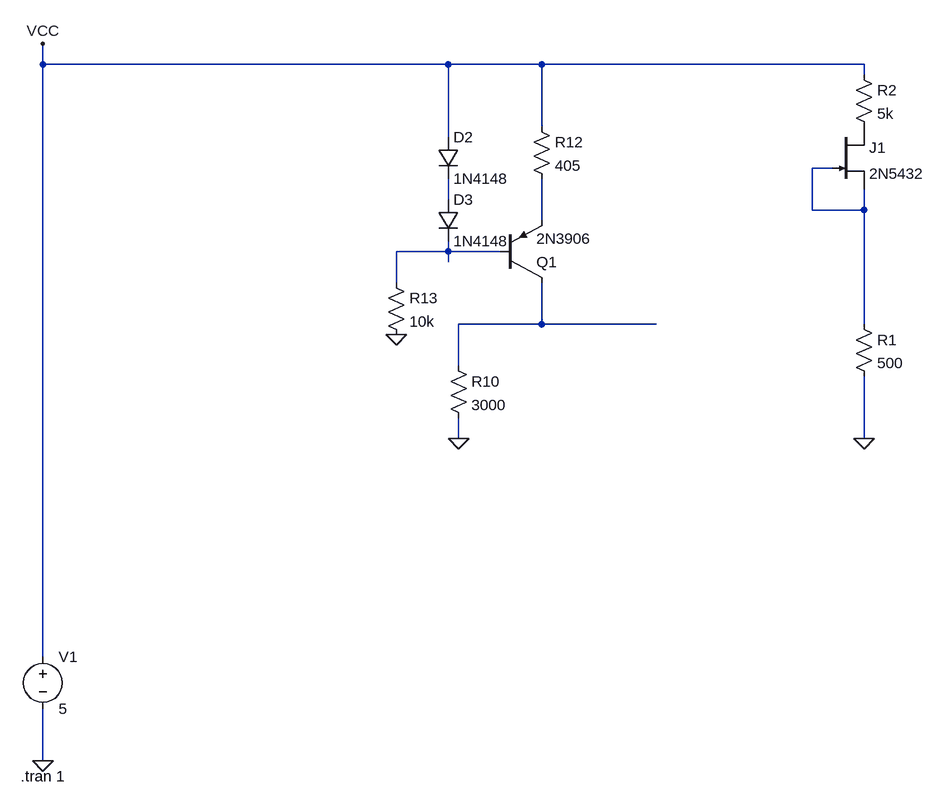
[diagram p0: schematic ccs-test.asc]
ccs-test.asc, the LTspice schematic file:
Version 4
SHEET 1 880 680
WIRE -544 -1104 -544 -1136
WIRE 80 -1104 -544 -1104
WIRE 224 -1104 80 -1104
WIRE 720 -1104 224 -1104
WIRE 720 -1088 720 -1104
WIRE 224 -1008 224 -1104
WIRE 80 -992 80 -1104
WIRE 672 -944 640 -944
WIRE 80 -896 80 -928
WIRE 640 -880 640 -944
WIRE 720 -880 720 -912
WIRE 720 -880 640 -880
WIRE 224 -864 224 -928
WIRE 80 -816 80 -832
WIRE 80 -816 0 -816
WIRE 160 -816 80 -816
WIRE 80 -800 80 -816
WIRE 0 -768 0 -816
WIRE 224 -704 224 -768
WIRE 224 -704 96 -704
WIRE 400 -704 224 -704
WIRE 720 -704 720 -880
WIRE 96 -640 96 -704
WIRE 96 -528 96 -560
WIRE 720 -528 720 -624
WIRE -544 -192 -544 -1104
WIRE -544 -32 -544 -112
FLAG -544 -32 0
FLAG -544 -1136 VCC
FLAG 0 -688 0
FLAG 96 -528 0
FLAG 720 -528 0
SYMBOL voltage -544 -208 R0
WINDOW 123 0 0 Left 2
WINDOW 39 0 0 Left 2
SYMATTR InstName V1
SYMATTR Value 5
SYMBOL res 80 -656 R0
SYMATTR InstName R10
SYMATTR Value 3000
SYMBOL diode 64 -992 R0
SYMATTR InstName D2
SYMATTR Value 1N4148
SYMBOL diode 64 -896 R0
SYMATTR InstName D3
SYMATTR Value 1N4148
SYMBOL res 208 -1024 R0
SYMATTR InstName R12
SYMATTR Value 405
SYMBOL res -16 -784 R0
SYMATTR InstName R13
SYMATTR Value 10k
SYMBOL pnp 160 -768 M180
SYMATTR InstName Q1
SYMATTR Value 2N3906
SYMBOL njf 672 -1008 R0
SYMATTR InstName J1
SYMATTR Value 2N5432
SYMBOL res 704 -720 R0
SYMATTR InstName R1
SYMATTR Value 500
SYMBOL res 704 -1104 R0
SYMATTR InstName R2
SYMATTR Value 5k
TEXT -578 -8 Left 2 !.tran 1

The netlist it stands for:
* ccs-test.asc
V1 VCC 0 5
R10 N005 0 3000
D2 VCC N002 1N4148
D3 N002 N004 1N4148
R12 VCC N003 405
R13 N004 0 10k
Q1 N005 N004 N003 0 2N3906
J1 P001 N001 N001 2N5432
R1 N001 0 500
R2 VCC P001 5k
.model D D
.lib standard.dio
.model NPN NPN
.model PNP PNP
.lib standard.bjt
.model NJF NJF
.model PJF PJF
.lib standard.jft
.tran 1
.backanno
.end